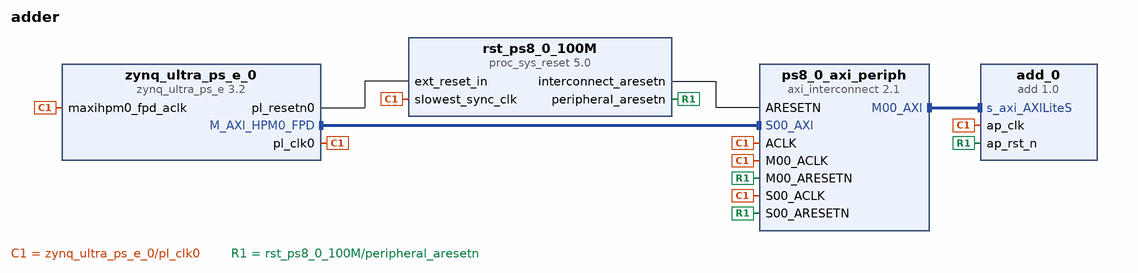
[diagram p0: block diagram of the top level]
# Vivado block design adder, xczu3eg-sbva484-1-e, Vivado 2018.2
create_bd_design adder

create_bd_cell -type ip -vlnv ChristianBillPedersen:CBP_lib:add:1.0 add_0
create_bd_cell -type ip -vlnv xilinx.com:ip:zynq_ultra_ps_e:3.2 zynq_ultra_ps_e_0
set_property -dict [list \
  CONFIG.PSU__PSS_REF_CLK__FREQMHZ 33.333333 \
  CONFIG.PSU__CAN1__PERIPHERAL__ENABLE 0 \
  CONFIG.PSU__DPAUX__PERIPHERAL__ENABLE 1 \
  CONFIG.PSU__DPAUX__PERIPHERAL__IO {MIO 27 .. 30} \
  CONFIG.PSU__FPGA_PL0_ENABLE 1 \
  CONFIG.PSU__ENET3__PERIPHERAL__ENABLE 0 \
  CONFIG.PSU__GPIO0_MIO__PERIPHERAL__ENABLE 1 \
  CONFIG.PSU__GPIO0_MIO__IO {MIO 0 .. 25} \
  CONFIG.PSU__GPIO1_MIO__PERIPHERAL__ENABLE 1 \
  CONFIG.PSU__GPIO1_MIO__IO {MIO 26 .. 51} \
  CONFIG.PSU__GPIO2_MIO__PERIPHERAL__ENABLE 1 \
  CONFIG.PSU__GPIO2_MIO__IO {MIO 52 .. 77} \
  CONFIG.PSU__I2C0__PERIPHERAL__ENABLE 0 \
  CONFIG.PSU__I2C1__PERIPHERAL__ENABLE 1 \
  CONFIG.PSU__I2C1__PERIPHERAL__IO {MIO 4 .. 5} \
  CONFIG.PSU__GT__LINK_SPEED HBR \
  CONFIG.PSU__GT__VLT_SWNG_LVL_4 0 \
  CONFIG.PSU__GT__PRE_EMPH_LVL_4 0 \
  CONFIG.PSU__USB0__REF_CLK_SEL {Ref Clk0} \
  CONFIG.PSU__USB0__REF_CLK_FREQ 26 \
  CONFIG.PSU__USB1__REF_CLK_SEL {Ref Clk0} \
  CONFIG.PSU__USB1__REF_CLK_FREQ 26 \
  CONFIG.PSU__DP__REF_CLK_SEL {Ref Clk1} \
  CONFIG.PSU__DP__REF_CLK_FREQ 27 \
  CONFIG.PSU__DP__LANE_SEL {Dual Lower} \
  CONFIG.SUBPRESET1 Custom \
  CONFIG.PSU__PMU__AIBACK__ENABLE 0 \
  CONFIG.PSU__PMU__PLERROR__ENABLE 0 \
  CONFIG.PSU__PMU__PERIPHERAL__ENABLE 1 \
  CONFIG.PSU__PMU__EMIO_GPI__ENABLE 0 \
  CONFIG.PSU__PMU__EMIO_GPO__ENABLE 0 \
  CONFIG.PSU__PMU__GPI0__ENABLE 1 \
  CONFIG.PSU__PMU__GPI1__ENABLE 0 \
  CONFIG.PSU__PMU__GPI2__ENABLE 0 \
  CONFIG.PSU__PMU__GPI3__ENABLE 0 \
  CONFIG.PSU__PMU__GPI4__ENABLE 0 \
  CONFIG.PSU__PMU__GPI5__ENABLE 0 \
  CONFIG.PSU__PMU__GPO0__ENABLE 1 \
  CONFIG.PSU__PMU__GPO1__ENABLE 1 \
  CONFIG.PSU__PMU__GPO2__ENABLE 1 \
  CONFIG.PSU__PMU__GPO3__ENABLE 0 \
  CONFIG.PSU__PMU__GPO4__ENABLE 0 \
  CONFIG.PSU__PMU__GPO5__ENABLE 0 \
  CONFIG.PSU__PMU__GPI0__IO {MIO 26} \
  CONFIG.PSU__PMU__GPO0__IO {MIO 32} \
  CONFIG.PSU__PMU__GPO1__IO {MIO 33} \
  CONFIG.PSU__PMU__GPO2__IO {MIO 34} \
  CONFIG.PSU__PMU__GPO2__POLARITY high \
  CONFIG.PSU__QSPI__PERIPHERAL__ENABLE 0 \
  CONFIG.PSU__SD0__PERIPHERAL__ENABLE 1 \
  CONFIG.PSU__SD0__PERIPHERAL__IO {MIO 13 .. 16 21 22} \
  CONFIG.PSU__SD0__GRP_CD__ENABLE 1 \
  CONFIG.PSU__SD0__GRP_CD__IO {MIO 24} \
  CONFIG.PSU__SD0__SLOT_TYPE {SD 2.0} \
  CONFIG.PSU__SD0__DATA_TRANSFER_MODE 4Bit \
  CONFIG.PSU__SD1__PERIPHERAL__ENABLE 1 \
  CONFIG.PSU__SD1__PERIPHERAL__IO {MIO 46 .. 51} \
  CONFIG.PSU__SD1__GRP_CD__ENABLE 0 \
  CONFIG.PSU__SD1__GRP_POW__ENABLE 0 \
  CONFIG.PSU__SD1__GRP_WP__ENABLE 0 \
  CONFIG.PSU__SD1__SLOT_TYPE {SD 2.0} \
  CONFIG.PSU__SD1__DATA_TRANSFER_MODE 4Bit \
  CONFIG.PSU__SPI0__PERIPHERAL__ENABLE 1 \
  CONFIG.PSU__SPI0__PERIPHERAL__IO {MIO 38 .. 43} \
  CONFIG.PSU__SPI0__GRP_SS0__IO {MIO 41} \
  CONFIG.PSU__SPI1__PERIPHERAL__ENABLE 1 \
  CONFIG.PSU__SPI1__PERIPHERAL__IO {MIO 6 .. 11} \
  CONFIG.PSU__SPI1__GRP_SS0__IO {MIO 9} \
  CONFIG.PSU__SWDT0__PERIPHERAL__ENABLE 1 \
  CONFIG.PSU__SWDT0__CLOCK__ENABLE 0 \
  CONFIG.PSU__SWDT0__RESET__ENABLE 0 \
  CONFIG.PSU__SWDT1__PERIPHERAL__ENABLE 1 \
  CONFIG.PSU__SWDT1__CLOCK__ENABLE 0 \
  CONFIG.PSU__SWDT1__RESET__ENABLE 0 \
  CONFIG.PSU__UART0__BAUD_RATE 115200 \
  CONFIG.PSU__TTC0__PERIPHERAL__ENABLE 1 \
  CONFIG.PSU__TTC0__CLOCK__ENABLE 0 \
  CONFIG.PSU__TTC0__WAVEOUT__ENABLE 0 \
  CONFIG.PSU__TTC1__PERIPHERAL__ENABLE 1 \
  CONFIG.PSU__UART1__BAUD_RATE 115200 \
  CONFIG.PSU__TTC1__CLOCK__ENABLE 0 \
  CONFIG.PSU__TTC1__WAVEOUT__ENABLE 0 \
  CONFIG.PSU__TTC2__PERIPHERAL__ENABLE 1 \
  CONFIG.PSU__TTC2__CLOCK__ENABLE 0 \
  CONFIG.PSU__TTC2__WAVEOUT__ENABLE 0 \
  CONFIG.PSU__TTC3__PERIPHERAL__ENABLE 1 \
  CONFIG.PSU__TTC3__CLOCK__ENABLE 0 \
  CONFIG.PSU__TTC3__WAVEOUT__ENABLE 0 \
  CONFIG.PSU__CSUPMU__PERIPHERAL__VALID 1 \
  CONFIG.PSU__DDRC__BUS_WIDTH {32 Bit} \
  CONFIG.PSU__DDRC__DEVICE_CAPACITY {16384 MBits} \
  CONFIG.PSU__DDRC__DRAM_WIDTH {32 Bits} \
  CONFIG.PSU__DDRC__ECC Disabled \
  CONFIG.PSU__DDRC__MEMORY_TYPE {LPDDR 4} \
  CONFIG.PSU__DDRC__SPEED_BIN LPDDR4_1066 \
  CONFIG.PSU__UART0__PERIPHERAL__ENABLE 1 \
  CONFIG.PSU__UART0__PERIPHERAL__IO {MIO 2 .. 3} \
  CONFIG.PSU__UART0__MODEM__ENABLE 0 \
  CONFIG.PSU__UART1__PERIPHERAL__ENABLE 1 \
  CONFIG.PSU__UART1__PERIPHERAL__IO {MIO 0 .. 1} \
  CONFIG.PSU__UART1__MODEM__ENABLE 0 \
  CONFIG.PSU__USB0__PERIPHERAL__ENABLE 1 \
  CONFIG.PSU__USB0__PERIPHERAL__IO {MIO 52 .. 63} \
  CONFIG.PSU__USB1__PERIPHERAL__ENABLE 1 \
  CONFIG.PSU__USB1__PERIPHERAL__IO {MIO 64 .. 75} \
  CONFIG.PSU__USB3_0__PERIPHERAL__ENABLE 1 \
  CONFIG.PSU__USB3_0__PERIPHERAL__IO {GT Lane2} \
  CONFIG.PSU__USB3_1__PERIPHERAL__ENABLE 1 \
  CONFIG.PSU__USB3_1__PERIPHERAL__IO {GT Lane3} \
  CONFIG.PSU__USB3_0__EMIO__ENABLE 0 \
  CONFIG.PSU__USB2_0__EMIO__ENABLE 0 \
  CONFIG.PSU__USE__M_AXI_GP0 1 \
  CONFIG.PSU__MAXIGP0__DATA_WIDTH 128 \
  CONFIG.PSU__USE__M_AXI_GP1 0 \
  CONFIG.PSU__USE__M_AXI_GP2 0 \
  CONFIG.PSU__USE__IRQ0 1 \
  CONFIG.PSU__PRESET_APPLIED 1 \
  CONFIG.PSU__DDR_HIGH_ADDRESS_GUI_ENABLE 0 \
  CONFIG.PSU_BANK_0_IO_STANDARD LVCMOS18 \
  CONFIG.PSU_BANK_1_IO_STANDARD LVCMOS18 \
  CONFIG.PSU_BANK_2_IO_STANDARD LVCMOS18 \
  CONFIG.PSU_BANK_3_IO_STANDARD LVCMOS18 \
  CONFIG.PSU__DISPLAYPORT__PERIPHERAL__ENABLE 1 \
  CONFIG.PSU__DISPLAYPORT__LANE0__ENABLE 1 \
  CONFIG.PSU__DISPLAYPORT__LANE0__IO {GT Lane1} \
  CONFIG.PSU__DISPLAYPORT__LANE1__ENABLE 1 \
  CONFIG.PSU__DISPLAYPORT__LANE1__IO {GT Lane0} \
  CONFIG.PSU__SATA__PERIPHERAL__ENABLE 0 \
  CONFIG.PSU__CRL_APB__USB3__ENABLE 1 \
  CONFIG.PSU__CRF_APB__APLL_CTRL__SRCSEL PSS_REF_CLK \
  CONFIG.PSU__CRF_APB__DPLL_CTRL__SRCSEL PSS_REF_CLK \
  CONFIG.PSU__CRF_APB__VPLL_CTRL__SRCSEL PSS_REF_CLK \
  CONFIG.PSU__CRF_APB__ACPU_CTRL__SRCSEL APLL \
  CONFIG.PSU__CRF_APB__DBG_TRACE_CTRL__SRCSEL IOPLL \
  CONFIG.PSU__CRF_APB__DBG_FPD_CTRL__SRCSEL IOPLL \
  CONFIG.PSU__CRF_APB__DP_VIDEO_REF_CTRL__SRCSEL VPLL \
  CONFIG.PSU__CRF_APB__DP_AUDIO_REF_CTRL__SRCSEL RPLL \
  CONFIG.PSU__CRF_APB__DP_STC_REF_CTRL__SRCSEL RPLL \
  CONFIG.PSU__CRF_APB__DDR_CTRL__SRCSEL DPLL \
  CONFIG.PSU__CRF_APB__GPU_REF_CTRL__SRCSEL IOPLL \
  CONFIG.PSU__CRL_APB__PL0_REF_CTRL__SRCSEL IOPLL \
  CONFIG.PSU__CRF_APB__GDMA_REF_CTRL__SRCSEL APLL \
  CONFIG.PSU__CRF_APB__DPDMA_REF_CTRL__SRCSEL APLL \
  CONFIG.PSU__CRF_APB__TOPSW_MAIN_CTRL__SRCSEL DPLL \
  CONFIG.PSU__CRF_APB__TOPSW_LSBUS_CTRL__SRCSEL IOPLL \
  CONFIG.PSU__CRF_APB__DBG_TSTMP_CTRL__SRCSEL IOPLL \
  CONFIG.PSU__CRL_APB__IOPLL_CTRL__SRCSEL PSS_REF_CLK \
  CONFIG.PSU__CRL_APB__RPLL_CTRL__SRCSEL PSS_REF_CLK \
  CONFIG.PSU__CRL_APB__GEM3_REF_CTRL__SRCSEL IOPLL \
  CONFIG.PSU__CRL_APB__USB0_BUS_REF_CTRL__SRCSEL IOPLL \
  CONFIG.PSU__CRL_APB__QSPI_REF_CTRL__SRCSEL IOPLL \
  CONFIG.PSU__CRL_APB__SDIO1_REF_CTRL__SRCSEL IOPLL \
  CONFIG.PSU__CRL_APB__UART0_REF_CTRL__SRCSEL IOPLL \
  CONFIG.PSU__CRL_APB__UART1_REF_CTRL__SRCSEL IOPLL \
  CONFIG.PSU__CRL_APB__I2C0_REF_CTRL__SRCSEL IOPLL \
  CONFIG.PSU__CRL_APB__I2C1_REF_CTRL__SRCSEL IOPLL \
  CONFIG.PSU__CRL_APB__CAN1_REF_CTRL__SRCSEL IOPLL \
  CONFIG.PSU__CRL_APB__CPU_R5_CTRL__SRCSEL IOPLL \
  CONFIG.PSU__CRL_APB__IOU_SWITCH_CTRL__SRCSEL IOPLL \
  CONFIG.PSU__CRL_APB__PCAP_CTRL__SRCSEL IOPLL \
  CONFIG.PSU__CRL_APB__LPD_LSBUS_CTRL__SRCSEL IOPLL \
  CONFIG.PSU__CRL_APB__LPD_SWITCH_CTRL__SRCSEL IOPLL \
  CONFIG.PSU__CRL_APB__DBG_LPD_CTRL__SRCSEL IOPLL \
  CONFIG.PSU__CRL_APB__ADMA_REF_CTRL__SRCSEL IOPLL \
  CONFIG.PSU__CRL_APB__TIMESTAMP_REF_CTRL__SRCSEL IOPLL \
  CONFIG.PSU__CRL_APB__USB3_DUAL_REF_CTRL__SRCSEL IOPLL \
  CONFIG.PSU__IOU_SLCR__IOU_TTC_APB_CLK__TTC0_SEL APB \
  CONFIG.PSU__IOU_SLCR__IOU_TTC_APB_CLK__TTC1_SEL APB \
  CONFIG.PSU__IOU_SLCR__IOU_TTC_APB_CLK__TTC2_SEL APB \
  CONFIG.PSU__IOU_SLCR__IOU_TTC_APB_CLK__TTC3_SEL APB \
  CONFIG.PSU__OVERRIDE__BASIC_CLOCK 0 \
  CONFIG.PSU__DLL__ISUSED 1 \
  CONFIG.PSU__DDR__INTERFACE__FREQMHZ 266.500 \
  CONFIG.PSU__CRF_APB__ACPU_CTRL__FREQMHZ 1200 \
  CONFIG.PSU__CRF_APB__DBG_TRACE_CTRL__FREQMHZ 250 \
  CONFIG.PSU__CRF_APB__DBG_FPD_CTRL__FREQMHZ 250 \
  CONFIG.PSU__CRF_APB__DDR_CTRL__FREQMHZ 533 \
  CONFIG.PSU__CRF_APB__GPU_REF_CTRL__FREQMHZ 500 \
  CONFIG.PSU__CRL_APB__PL0_REF_CTRL__FREQMHZ 100 \
  CONFIG.PSU__CRF_APB__GDMA_REF_CTRL__FREQMHZ 600 \
  CONFIG.PSU__CRF_APB__DPDMA_REF_CTRL__FREQMHZ 600 \
  CONFIG.PSU__CRF_APB__TOPSW_MAIN_CTRL__FREQMHZ 533.33 \
  CONFIG.PSU__CRF_APB__TOPSW_LSBUS_CTRL__FREQMHZ 100 \
  CONFIG.PSU__CRF_APB__DBG_TSTMP_CTRL__FREQMHZ 250 \
  CONFIG.PSU__CRL_APB__GEM3_REF_CTRL__FREQMHZ 125 \
  CONFIG.PSU__CRL_APB__USB0_BUS_REF_CTRL__FREQMHZ 250 \
  CONFIG.PSU__CRL_APB__QSPI_REF_CTRL__FREQMHZ 125 \
  CONFIG.PSU__CRL_APB__SDIO1_REF_CTRL__FREQMHZ 200 \
  CONFIG.PSU__CRL_APB__UART0_REF_CTRL__FREQMHZ 100 \
  CONFIG.PSU__CRL_APB__UART1_REF_CTRL__FREQMHZ 100 \
  CONFIG.PSU__CRL_APB__I2C0_REF_CTRL__FREQMHZ 100 \
  CONFIG.PSU__CRL_APB__I2C1_REF_CTRL__FREQMHZ 100 \
  CONFIG.PSU__CRL_APB__CAN1_REF_CTRL__FREQMHZ 100 \
  CONFIG.PSU__CRL_APB__CPU_R5_CTRL__FREQMHZ 500 \
  CONFIG.PSU__CRL_APB__IOU_SWITCH_CTRL__FREQMHZ 250 \
  CONFIG.PSU__CRL_APB__PCAP_CTRL__FREQMHZ 200 \
  CONFIG.PSU__CRL_APB__LPD_LSBUS_CTRL__FREQMHZ 100 \
  CONFIG.PSU__CRL_APB__LPD_SWITCH_CTRL__FREQMHZ 500 \
  CONFIG.PSU__CRL_APB__DBG_LPD_CTRL__FREQMHZ 250 \
  CONFIG.PSU__CRL_APB__ADMA_REF_CTRL__FREQMHZ 500 \
  CONFIG.PSU__CRL_APB__TIMESTAMP_REF_CTRL__FREQMHZ 100 \
  CONFIG.PSU__CRL_APB__USB3_DUAL_REF_CTRL__FREQMHZ 20 \
  CONFIG.PSU__PMU_COHERENCY 0 \
  CONFIG.PSU__USB0_COHERENCY 0 \
  CONFIG.PSU__SD1_COHERENCY 0 \
] [get_bd_cells zynq_ultra_ps_e_0]
# 122 more settings of zynq_ultra_ps_e_0 are not shown: defaults, MIO pin electricals, DDR timing, and values the tool derives
create_bd_cell -type ip -vlnv xilinx.com:ip:axi_interconnect:2.1 ps8_0_axi_periph
set_property -dict {CONFIG.NUM_MI 1} [get_bd_cells ps8_0_axi_periph]
create_bd_cell -type ip -vlnv xilinx.com:ip:proc_sys_reset:5.0 rst_ps8_0_100M

# ---- connections ----

connect_bd_intf_net [get_bd_intf_pins zynq_ultra_ps_e_0/M_AXI_HPM0_FPD] [get_bd_intf_pins ps8_0_axi_periph/S00_AXI]
connect_bd_intf_net [get_bd_intf_pins ps8_0_axi_periph/M00_AXI] [get_bd_intf_pins add_0/s_axi_AXILiteS]
connect_bd_net [get_bd_pins zynq_ultra_ps_e_0/pl_clk0] \
  [get_bd_pins zynq_ultra_ps_e_0/maxihpm0_fpd_aclk] [get_bd_pins ps8_0_axi_periph/S00_ACLK] \
  [get_bd_pins rst_ps8_0_100M/slowest_sync_clk] [get_bd_pins add_0/ap_clk] [get_bd_pins ps8_0_axi_periph/M00_ACLK] \
  [get_bd_pins ps8_0_axi_periph/ACLK]
connect_bd_net [get_bd_pins zynq_ultra_ps_e_0/pl_resetn0] [get_bd_pins rst_ps8_0_100M/ext_reset_in]
connect_bd_net [get_bd_pins rst_ps8_0_100M/peripheral_aresetn] \
  [get_bd_pins ps8_0_axi_periph/S00_ARESETN] [get_bd_pins add_0/ap_rst_n] [get_bd_pins ps8_0_axi_periph/M00_ARESETN]
connect_bd_net [get_bd_pins rst_ps8_0_100M/interconnect_aresetn] [get_bd_pins ps8_0_axi_periph/ARESETN]

# ---- address map ----
assign_bd_address -offset 0x000A0000000 -range 64K -target_address_space [get_bd_addr_spaces zynq_ultra_ps_e_0/Data] [get_bd_addr_segs add_0/s_axi_AXILiteS/Reg]

validate_bd_design
save_bd_design
